# Altium schematic sheet Sheet5_old.SchDoc
size A
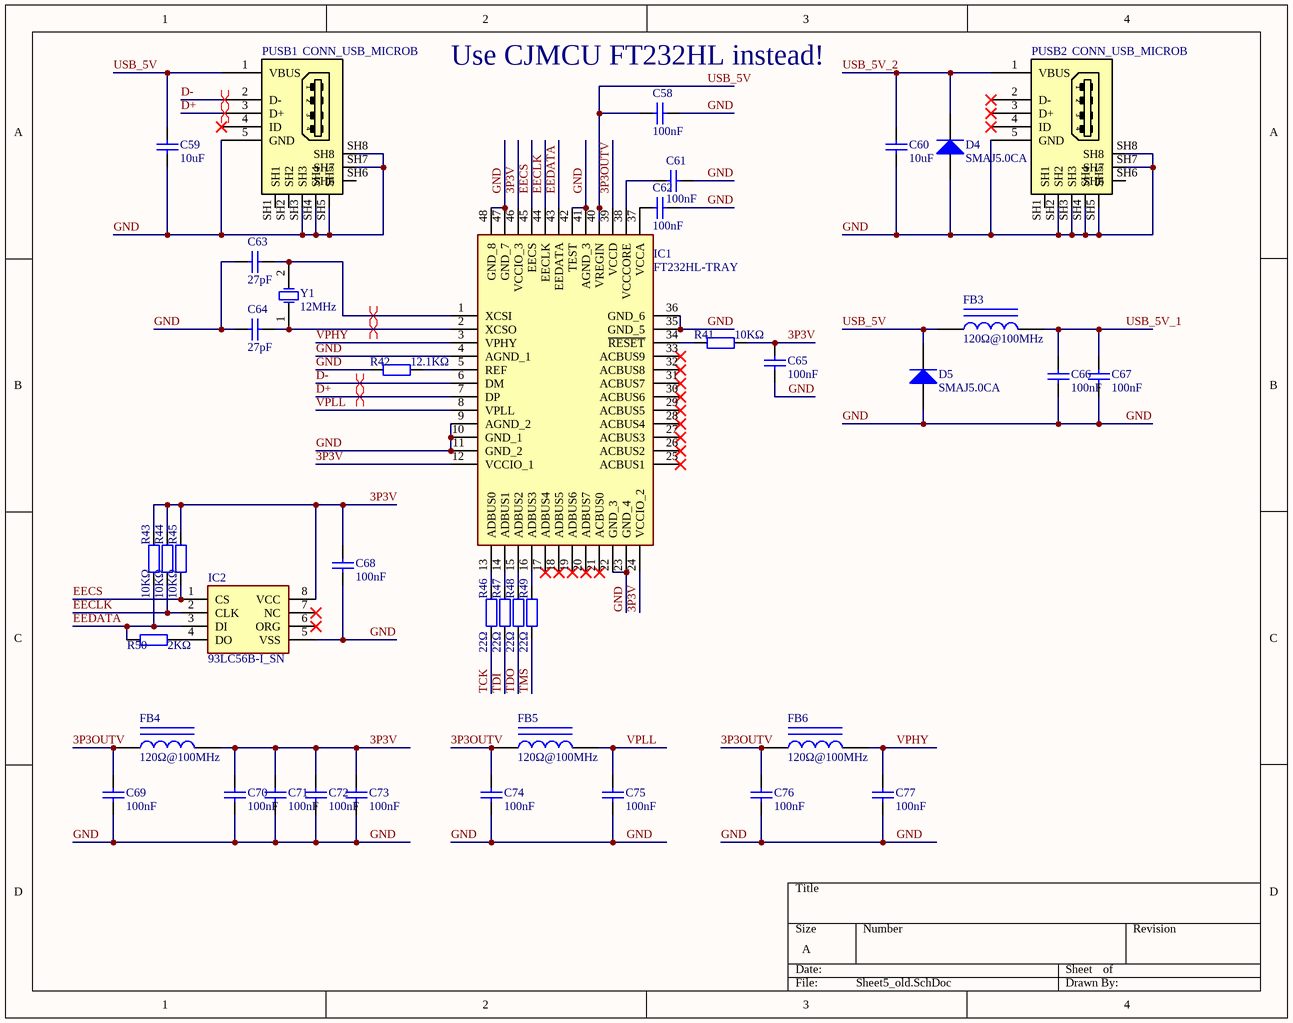
[diagram p0: Sheet5_old.SchDoc]

## Parts
C58  100nF  [1206_C]
C59  10uF  [1206_C]
C60  10uF  [1206_C]
C61  100nF  [1206_C]
C62  100nF  [1206_C]
C63  27pF  [0805_C]
C64  27pF  [0805_C]
C65  100nF  [1206_C]
C66  100nF  [1206_C]
C67  100nF  [1206_C]
C68  100nF  [1206_C]
C69  100nF  [1206_C]
C70  100nF  [1206_C]
C71  100nF  [1206_C]
C72  100nF  [1206_C]
C73  100nF  [1206_C]
C74  100nF  [1206_C]
C75  100nF  [1206_C]
C76  100nF  [1206_C]
C77  100nF  [1206_C]
D4  SMAJ5.0CA  [SMA(DO-214AC)_S1]
D5  SMAJ5.0CA  [SMA(DO-214AC)_S1]
FB3  120Ω@100MHz  [0805_L]
FB4  120Ω@100MHz  [0805_L]
FB5  120Ω@100MHz  [0805_L]
FB6  120Ω@100MHz  [0805_L]
IC1  FT232HL-TRAY  [QFP50P900X900X160-48N]
IC2  93LC56B-I_SN  [SOIC127P600X175-8N]
PUSB1  CONN_USB_MICROB  [USB_MICRO_B_BM_SHT1]
PUSB2  CONN_USB_MICROB  [USB_MICRO_B_BM_SHT1]
R41  10KΩ  [1206_R]
R42  12.1KΩ  [0805_R]
R43  10KΩ  [1206_R]
R44  10KΩ  [1206_R]
R45  10KΩ  [1206_R]
R46  22Ω  [1206_R]
R47  22Ω  [1206_R]
R48  22Ω  [1206_R]
R49  22Ω  [1206_R]
R50  2KΩ  [1206_R]
Y1  12MHz  [SMD-5032_2P]

## Nets
3P3OUTV: C69.2 C74.2 C76.2 FB4.1 FB5.1 FB6.1 IC1.39(VCCD)
3P3V: C65.2 C68.2 C70.2 C71.2 C72.2 C73.2 FB4.2 IC1.12(VCCIO_1) IC1.24(VCCIO_2) IC1.46(VCCIO_3) IC2.8(VCC) R41.2 R43.2 R44.2 R45.2
D+: IC1.7(DP) PUSB1.3(D+)
D-: IC1.6(DM) PUSB1.2(D-)
EECLK: IC1.44(EECLK) IC2.2(CLK) R44.1
EECS: IC1.45(EECS) IC2.1(CS) R45.1
EEDATA: IC1.43(EEDATA) IC2.3(DI) R43.1 R50.1
GND: C58.2 C59.1 C60.1 C61.2 C62.2 C63.1 C64.1 C65.1 C66.1 C67.1 C68.1 C69.1 C70.1 C71.1 C72.1 C73.1 C74.1 C75.1 C76.1 C77.1 D4.1(A) D5.1(A) IC1.4(AGND_1) IC1.9(AGND_2) IC1.10(GND_1) IC1.11(GND_2) IC1.22(GND_3) IC1.23(GND_4) IC1.35(GND_5) IC1.36(GND_6) IC1.41(AGND_3) IC1.42(TEST) IC1.47(GND_7) IC1.48(GND_8) IC2.5(VSS) PUSB1.5(GND) PUSB1.SH3 PUSB1.SH4 PUSB1.SH5 PUSB1.SH7 PUSB1.SH8 PUSB2.5(GND) PUSB2.SH2 PUSB2.SH3 PUSB2.SH4 PUSB2.SH5 PUSB2.SH7 PUSB2.SH8 R42.1
TCK: R46.1
TDI: R47.1
TDO: R48.1
TMS: R49.1
USB_5V: C58.1 C59.2 D5.2(K) FB3.1 IC1.40(VREGIN) PUSB1.1(VBUS)
USB_5V_1: C66.2 C67.2 FB3.2
USB_5V_2: C60.2 D4.2(K) PUSB2.1(VBUS)
VPHY: C77.2 FB6.2 IC1.3(VPHY)
VPLL: C75.2 FB5.2 IC1.8(VPLL)
NetC61_1: C61.1 IC1.38(VCCCORE)
NetC62_1: C62.1 IC1.37(VCCA)
NetC63_2: C63.2 IC1.1(XCSI) Y1.2(OSC2)
NetC64_2: C64.2 IC1.2(XCSO) Y1.1(OSC1)
NetIC1_5: IC1.5(REF) R42.2
NetIC1_13: IC1.13(ADBUS0) R46.2
NetIC1_14: IC1.14(ADBUS1) R47.2
NetIC1_15: IC1.15(ADBUS2) R48.2
NetIC1_16: IC1.16(ADBUS3) R49.2
NetIC1_34: IC1.34(~{RESET}) R41.1
NetIC2_4: IC2.4(DO) R50.2

Not connected (* = marked no-connect by the designer): IC1 17(ADBUS4)* 18(ADBUS5)* 19(ADBUS6)* 20(ADBUS7)* 21(ACBUS0)* 25(ACBUS1)* 26(ACBUS2)* 27(ACBUS3)* 28(ACBUS4)* 29(ACBUS5)* 30(ACBUS6)* 31(ACBUS7)* 32(ACBUS8)* 33(ACBUS9)*; IC2 6(ORG)* 7(NC)*; PUSB1 4(ID)* SH1 SH2 SH6; PUSB2 2(D-)* 3(D+)* 4(ID)* SH1 SH6

## Layout directives
differential pair: D+, D-, NetC63_2, NetC64_2

## Notes on the sheet
- (near C58) Use CJMCU FT232HL instead!

## Library data of the parts
C58 C61 C62 C65-C77 = 1206 100nF (104) 10% 50V: 贴片电容; ComponentLink1Description: 供应商链接; ComponentLink1URL: http://www.szlcsc.com/product/details_25237.html; Package: 1206; Supplier: LC; SuppliersPartNumber: C24497
C59 C60 = 1206 10uF (106) 10% 50V: 贴片电容; ComponentLink1Description: 供应商链接; ComponentLink1URL: http://www.szlcsc.com/product/details_14236.html; Package: 1206; Supplier: LC; SuppliersPartNumber: C13585
C63 C64 = 0805 27pF (270) 5% 50V: 贴片电容; ComponentLink1Description: 供应商链接; ComponentLink1URL: http://www.szlcsc.com/product/details_8509.html; Package: 0805; Supplier: LC; SuppliersPartNumber: C8031
D4 D5 = SMA(DO-214AC) SS210: 二极管 TVS; ComponentLink1Description: 供应商链接; ComponentLink1URL: http://www.szlcsc.com/product/details_15669.html; Package: SMA(DO-214AC); Supplier: LC; SuppliersPartNumber: C14996
FB3-FB6 = 0805 100Ω 25% 100MHz: 贴片磁珠; ComponentLink1Description: 供应商链接; ComponentLink1URL: http://www.szlcsc.com/product/details_1367.html; Package: 0805; Supplier: LC; SuppliersPartNumber: C1015
IC1 = FT232HL-TRAY: Integrated Circuit; Manufacturer_Name: FTDI Chip; Datasheet Link: https://www.ftdichip.com/Support/Documents/DataSheets/ICs/DS_FT232H.pdf; Height: 1.6mm; Manufacturer_Part_Number: FT232HL-TRAY; Arrow Part Number: FT232HL-TRAY; Arrow Price/Stock: https://www.arrow.com/en/products/ft232hl-tray/ftdi-chip; Mouser Part Number: 895-FT232HL-TRAY; Mouser Price/Stock: https://www.mouser.co.uk/ProductDetail/FTDI/FT232HL-TRAY?qs=rzPzygjq8vJvP%252BgUCAJn1A%3D%3D
IC2 = 93LC56B-I_SN: Integrated Circuit; Manufacturer_Name: Microchip; Manufacturer_Part_Number: 93LC56B-I/SN; Datasheet Link: http://ww1.microchip.com/downloads/en/DeviceDoc/21794G.pdf; Height: 1.75mm; Arrow Part Number: 93LC56B-I/SN; Arrow Price/Stock: https://www.arrow.com/en/products/93lc56b-isn/microchip-technology; Mouser Part Number: 579-93LC56BISN; Mouser Price/Stock: https://www.mouser.co.uk/ProductDetail/Microchip-Technology/93LC56B-I-SN?qs=JhC4kYev1ubTO3jC60ECfA%3D%3D
PUSB1 PUSB2 = CONN_USB_MICRO_B_BM_SHT1: CONN, USB, MICRO B, R/A, SMD, BOTTOM MOUNT, SHT; MANF_P#: 47590-0001; MANF: MOLEX; VALUE: CONN_USB_MICROB
R41 R43-R45 = 1206 10KΩ (1002) 1%: 贴片电阻; ComponentLink1Description: 供应商链接; ComponentLink1URL: http://www.szlcsc.com/product/details_18590.html; Package: 1206; Supplier: LC; SuppliersPartNumber: C17902
R42 = 0805 12KΩ (1202) 1%: 贴片电阻 12.1k; ComponentLink1Description: 供应商链接; ComponentLink1URL: http://www.szlcsc.com/product/details_18132.html; Package: 0805; Supplier: LC; SuppliersPartNumber: C17444
R46-R49 = 1206 22Ω (22R0) 1%: 贴片电阻; ComponentLink1Description: 供应商链接; ComponentLink1URL: http://www.szlcsc.com/product/details_18646.html; Package: 1206; Supplier: LC; SuppliersPartNumber: C17958
R50 = 1206 2KΩ (2001) 1%: 贴片电阻; ComponentLink1Description: 供应商链接; ComponentLink1URL: http://www.szlcsc.com/product/details_18632.html; Package: 1206; Supplier: LC; SuppliersPartNumber: C17944
Y1 = SMD-5032_2P 11.0592MHZ 20PF 20PPM: 贴片晶振 12MHz; ComponentLink1Description: 供应商链接; ComponentLink1URL: http://www.szlcsc.com/product/details_53039.html; Package: SMD-5032_2P; Supplier: LC; SuppliersPartNumber: C52026